# Altium schematic sheet 1.8V.SchDoc
size A4; SheetNumber: 6; SheetTotal: 8
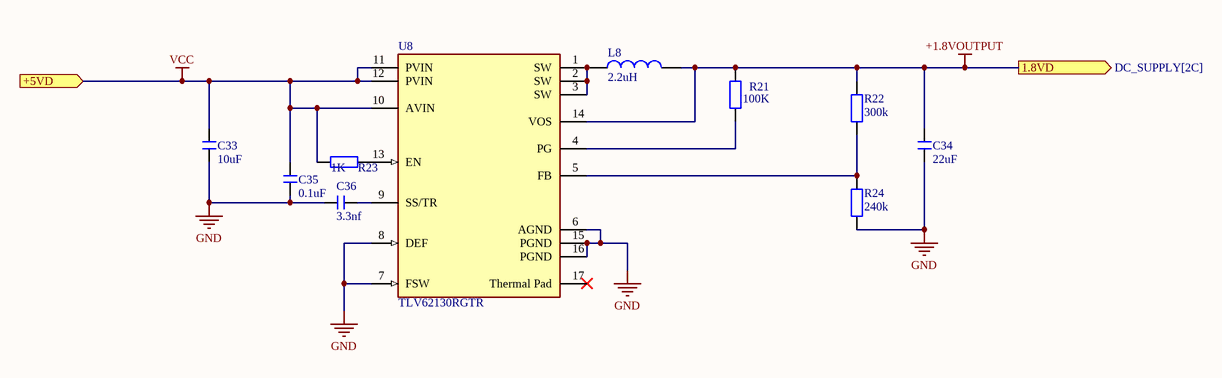
[diagram p0: 1.8V.SchDoc]

## Parts
C33  10uF  [C 0805_L]
C34  22uF  [C 0805_L]
C35  0.1uF  [C 0805_L]
C36  3.3nf  [C 0805_L]
L8  2.2uH  [L 0805]
R21  100K  [R 0805_L]
R22  300k  [R 0805_L]
R23  1K  [R 0805_L]
R24  240k  [R 0805_L]
U8  TLV62130RGTR  [FP-RGT0016C-IPC_A]

## Ports
1.8VD (out, see DC_SUPPLY[2C]), +5VD (in, see DC_SUPPLY[2C], 1.5V[2B], 1V[2A], 3.3V[2C], 5VD_and_5VDC_and_12V[3B], VTTVREF[2B])

## Nets
+1.8VOUTPUT: C34.2 L8.2 R21.2 R22.2 U8.14(VOS) ; port 1.8VD
GND: C33.1 C34.1 C35.1 C36.1 R24.1 U8.6(AGND) U8.7(FSW) U8.8(DEF) U8.15(PGND) U8.16(PGND)
VCC: C33.2 C35.2 R23.1 U8.10(AVIN) U8.11(PVIN) U8.12(PVIN) ; port +5VD
NetC36_2: C36.2 U8.9(SS/TR)
NetL8_1: L8.1 U8.1(SW) U8.2(SW) U8.3(SW)
NetR21_1: R21.1 U8.4(PG)
NetR22_1: R22.1 R24.2 U8.5(FB)
NetR23_2: R23.2 U8.13(EN)

Not connected (* = marked no-connect by the designer): U8 17(Thermal_Pad)*

## Library data of the parts
C33 = C: 贴片电容 10 µF, 25 V, Ceramic, 1210; BOM名称: 无极性贴片电容; 淘宝ID: 封装库来自淘宝 ID：黄晶宝石; 联系售后，技术支持: https://shop463601444.taobao.com; 唯一出售店铺网址: https://shop463601444.taobao.com
C34 = C: 贴片电容 22 µF, 6.3 V, Ceramic, 0805; BOM名称: 无极性贴片电容; 淘宝ID: 封装库来自淘宝 ID：黄晶宝石; 联系售后，技术支持: https://shop463601444.taobao.com; 唯一出售店铺网址: https://shop463601444.taobao.com
C35 = C: 贴片电容; BOM名称: 无极性贴片电容; 淘宝ID: 封装库来自淘宝 ID：黄晶宝石; 联系售后，技术支持: https://shop463601444.taobao.com; 唯一出售店铺网址: https://shop463601444.taobao.com
C36 = C: 贴片电容 3300 pF, 25 V, Ceramic, 0603; BOM名称: 无极性贴片电容; 淘宝ID: 封装库来自淘宝 ID：黄晶宝石; 联系售后，技术支持: https://shop463601444.taobao.com; 唯一出售店铺网址: https://shop463601444.taobao.com
L8 = L: 小功率贴片电感; 淘宝ID: 封装库来自淘宝 ID：黄晶宝石; 封装库来自淘宝卖家 ID：黄晶宝石: 其他店铺购入均为盗版，不享受售后技术支持服务，请立即申请退款; BOM名称: 小功率贴片电感; 联系售后: https://shop463601444.taobao.com
R21 R22 R24 = R: 贴片电阻; 版权归属: 来自淘宝 ID：黄晶宝石; 封装库来自淘宝卖家 ID：黄晶宝石: 其他店铺购入均为盗版，不享受售后技术支持服务，请立即申请退款; BOM名称: 贴片电阻; 联系售后: https://shop463601444.taobao.com
R23 = R: 贴片电阻R1 IMPORTANT, TO PREVENT HV DAMAGE; BOM名称: 贴片电阻; 版权归属: 来自淘宝 ID：黄晶宝石; 封装库来自淘宝卖家 ID：黄晶宝石: 其他店铺购入均为盗版，不享受售后技术支持服务，请立即申请退款; 联系售后: https://shop463601444.taobao.com
U8 = CMP-04918-000039-1: IC REG BUCK ADJUSTABLE 3A 16QFN; Manufacturer: Texas Instruments; Min Supply Voltage: 3V; Max Junction Temp: +125°C; Output Type: AdjustableProgrammable; Number Of Outputs: 1; Nominal Supply Current: 19uA; Standoff Height: 0mm; Max Supply Voltage: 17V; Switching Frequency: 1.25/2.5MHz; Max Duty Cycle: 100%; Output Voltage: 0.9-5.5V; ComponentLink2Description: Datasheet; Category: IC; Manufacturer Part Number: TLV62130RGTR; Mouser Description: Switching Voltage Regulators 4-17V 3A Step-Down Converter; Output Current: 3A; Ambient Temperature Range Low: -40°C; Package: RGT0016C; Lead Free: Yes; Temperature Range Low: -40°C; Digikey Description: IC REG BUCK ADJUSTABLE 3A 16QFN; Height: 1mm; Device Class L3: Voltage Regulators - Switching; Device Class L1: Integrated Circuits (ICs); Switching Topology: Buck; Ambient Temperature Range High: +85°C; RoHS: TRUE; Ipc Land Pattern Name: QFN50P300X300X100-16; Temperature: -40°C to +85°C; Octopart: https://octopart.com/tlv62130rgtr-texas+instruments-21766117; Device Class L2: Power Management ICs; Temperature Range High: +85°C; Automotive: No; ComponentLink2URL: http://www.ti.com/lit/ds/symlink/tlv62130.pdf